# EAGLE design ButtonLedBoard (EAGLE 9.6.2)
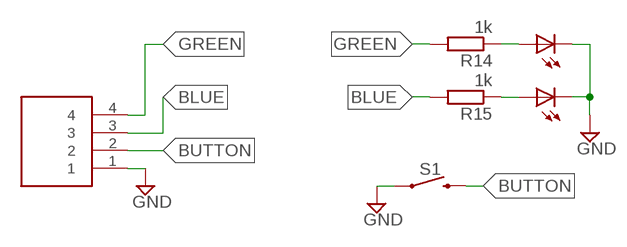
[diagram p0: schematic, sheet 1]

## Parts
J1  826629-4  [TE_826629-4]
LED1  LEDCHIP-LED0603  [CHIP-LED0603]
LED2  LEDCHIP-LED0603  [CHIP-LED0603]
R14  1k  R-EU_R0603  [R0603]
R15  1k  R-EU_R0603  [R0603]
S1  MOMENTARY-SWITCH-SPST-SMD-6.0X3.5MM  [TACTILE_SWITCH_SMD_6.0X3.5MM]

## Nets
BLUE: J1.3 R15.2
BUTTON: J1.2 S1.2
GND: J1.1 LED1.C LED2.C S1.1
GREEN: J1.4 R14.2
N$5: LED1.A R14.1
N$6: LED2.A R15.1

## Library data of the parts
J1 = 4_pin_header_small_holes:826629-4: CONN HEADER BRKWAWAY 4POS AU Check availability <https://pricing.snapeda.com/parts/826629-4/TE%20Connectivity/view-part?ref=eda>; AVAILABILITY: In Stock; COMMENT: 826629-4; DESCRIPTION: Conn Unshrouded Header HDR 4 POS 2.54mm Solder ST Thru-Hole Automotive Carton; EU_ROHS_COMPLIANCE: Compliant; MF: TE Connectivity; MP: 826629-4; PACKAGE: None; PRICE: None; PURCHASE-URL: https://pricing.snapeda.com/search/part/826629-4/?ref=eda
LED1 LED2 = adafruit_custom:LED: LED OSRAM: - CHIPLED LG R971, LG N971, LY N971, LG Q971, LY Q971, LO R971, LY R971 LH N974, LH R974 LS Q976, LO Q976, LY Q976 LO Q996 - Hyper CHIPLED LW Q18S LB Q993, LB Q99A, LB R99A - SideLED LS A670, LO A670, LY A670, LG A670, LP A670 LB A673, LV A673, LT A673, LW A673 LH A674 LY A675 LS A676, LA A676, LO A676, LY A676, LW A676 LS A679, LY A679, LG A679 - Hyper Micro SIDELED® LS Y876, LA Y876, LO Y876, LY Y876 LT Y87S - SmartLED LW L88C, LW L88S LB L89C, LB L89S, LG L890 LS L89K, LO L89K, LY L89K LS L896, LA L896, LO L896, LY L896 - TOPLED LS T670, LO T670, LY T670, LG T670, LP T670 LSG T670, LSP T670, LSY T670, LOP T670, LYG T670 LG T671, LOG T671, LSG T671 LB T673, LV T673, LT T673, LW T673 LH T674 LS T676, LA T676, LO T676, LY T676, LB T676, LH T676, LSB T676, LW T676 LB T67C, LV T67C, LT T67C, LS T67K, LO T67K, LY T67K, LW E67C LS E67B, LA E67B, LO E67B, LY E67B, LB E67C, LV E67C, LT E67C LW T67C LS T679, LY T679, LG T679 LS T770, LO T770, LY T770, LG T770, LP T770 LB T773, LV T773, LT T773, LW T773 LH T774 LS E675, LA E675, LY E675, LS T675 LS T776, LA T776, LO T776, LY T776, LB T776 LHGB T686 LT T68C, LB T68C - Hyper Mini TOPLED® LB M676 - Mini TOPLED Santana® LG M470 LS M47K, LO M47K, LY M47K Source: http://www.osram.convergy.de/
R14 R15 = rcl:R-EU_: RESISTOR, European symbol; SPICEPREFIX: R
S1 = SparkFun-Switches:MOMENTARY-SWITCH-SPST: Momentary Switch (Pushbutton) - SPST Normally-open (NO) SPST momentary switches (buttons, pushbuttons). Variants PTH-12MM - 12mm square, through-hole Momentary Pushbutton Switch - 12mm Square <https://www.sparkfun.com/products/9190> (COM-09190) PTH-6.0MM, PTH-6.0MM-KIT - 6.0mm square, through-hole Mini Pushbutton Switch <https://www.sparkfun.com/products/97> (COM-00097) KIT package intended for soldering kit's - only one side of pads' copper is exposed. PTH-RIGHT-ANGLE-KIT - Right-angle, through-hole Right Angle Tactile Button <https://www.sparkfun.com/products/10791> - Used on SparkFun BigTime Watch Kit <https://www.sparkfun.com/products/11734> SMD-12MM - 12mm square, surface-mount Tactile Button - SMD (12mm) <https://www.sparkfun.com/products/12993> (COM-12993) Used on SparkFun PicoBoard <https://www.sparkfun.com/products/11888> SMD-4.5MM - 4.5mm Square Trackball Switch Used on SparkFun Blackberry Trackballer Breakout <https://www.sparkfun.com/products/13169> SMD-4.6MMX2.8MM - 4.60mm x 2.80mm, surface mount Used on SparkFun SAMD21 Mini Breakout <https://www.sparkfun.com/products/13664> SMD-5.2MM, SMD-5.2-REDUNDANT - 5.2mm square, surface-mount Mini Pushbutton Switch - SMD <https://www.sparkfun.com/products/8720> (COM-08720) Used on Arduino Pro Mini <https://www.sparkfun.com/products/11114> REDUNDANT package connects both switch circuits together SMD-6.0X3.5MM - 6.0 x 3.5mm, surface mount Momentary Reset Switch SMD <https://www.sparkfun.com/products/8229> (COM-08229) SMD-6.2MM-TALL - 6.2mm square, surface mount Tactile Button - SMD (6mm) <https://www.sparkfun.com/products/12992> Used on SparkFun Digital Sandbox <https://www.sparkfun.com/products/12651> SMD-RIGHT-ANGLE - Right-angle, surface mount Used on SparkFun Block for Intel® Edison - Arduino <https://www.sparkfun.com/products/13036>; PROD_ID: SWCH-00815; SF_SKU: COM-08229

## Net classes
0 default: width 0.254 mm, drill 0.305 mm, clearance 0.152 mm

## Board
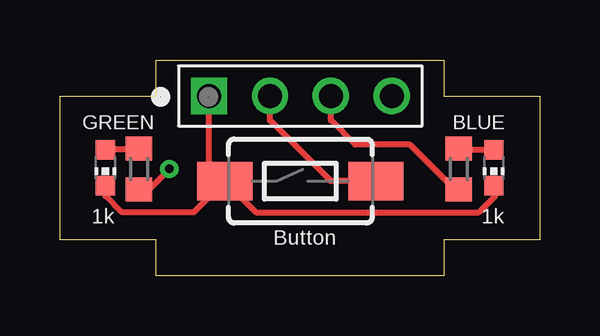
[diagram p1: board, top side]
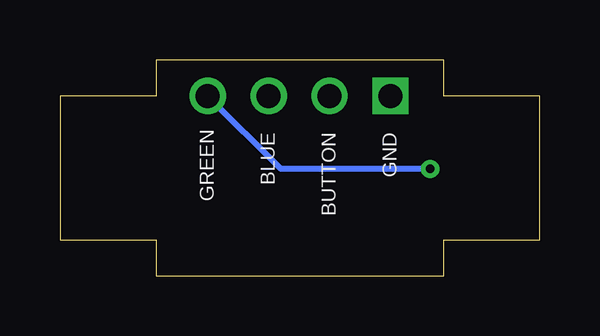
[diagram p2: board, bottom side, seen from below]

Size 20 x 9 mm. Coordinates in mm from the lower left corner, seen from the top.
Outline: 16,7.5 20,7.5 20,1.5 16,1.5 16,0 4,0 4,1.5 0,1.5 0,7.5 4,7.5 4,9 16,9 16,7.5
Copper layers (1*16): Top 0.035mm / dielectric 1.5mm / Bottom 0.035mm
Design rules "default": minimum track width 6mil, minimum drill 0.35mm, track to track 6mil, track to pad 6mil, pad to pad 6mil, via to via 6mil, smd to smd 6mil, copper to edge 40mil, drill to drill 6mil, minimum pad ring 10mil, minimum via ring 8mil, stop-mask expansion 4mil, vias tented up to drill 0mil, thermal gap 10mil

### Footprints (pad centres in the part's own frame; a part is rotated, then mirrored left to right if it is on the bottom)
TE_826629-4 = drill 1 square: 1 -3.81,0 | drill 1: 2 -1.27,0; 3 1.27,0; 4 3.81,0
CHIP-LED0603 = smd 0.8 x 0.8: A 0,-0.75; C 0,0.75
R0603 = smd 1 x 1.1: 1 -0.85,0; 2 0.85,0
TACTILE_SWITCH_SMD_6.0X3.5MM = smd 2.3 x 1.6: 1 -3.15,0; 2 3.15,0

### Placement (x,y rotation side)
J1  10.03,7.5 0 top
LED1  1.9,4.5 180 top
LED2  18.09,4.5 180 top
R14  3.29,4.45 270 top
R15  16.63,4.45 270 top
S1  10.03,3.94 0 top

### Tracks (layer width: path | path; a pad name or v marks a point on that pad's centre or on a via)
BLUE
  Top 0.254: R15.2 16.46,3.6 14.6,5.47 12.31,5.47 11.3,6.48 J1.3
BUTTON
  Top 0.254: 13.84,4.6 S1.2 11.3,3.94 8.76,6.48 J1.2
GND
  Top 0.254: S1.1 6.21,4.6 J1.1 | S1.1 5.57,2.64 2.58,2.64 1.9,3.32 LED1.C | S1.1 8.18,2.64 17.48,2.64 18.15,3.32 LED2.C
GREEN  (via drill 0.35)
  Top 0.254: R14.2 3.71,3.6 v4.56,4.45
  Bottom 0.254: J1.4 10.79,4.45 v4.56,4.45
N$5
  Top 0.254: R14.1 3.19,5.2 | R14.1 3.27,5.28 | R14.1 3.25,5.25 LED1.A
N$6
  Top 0.254: R15.1 16.73,5.2 | R15.1 16.65,5.28 | R15.1 16.68,5.25 LED2.A

### Text on the board
tPlace: GREEN | BLUE | Button
bPlace: GND | BUTTON | BLUE | GREEN